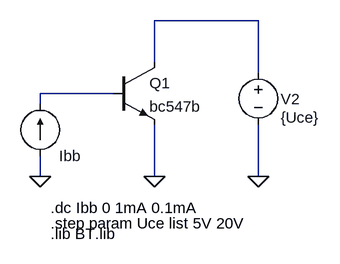
[diagram p0: schematic BT-CE-TRAN-2.asc]
BT-CE-TRAN-2.asc, the LTspice schematic file:
Version 4
SHEET 1 880 680
WIRE 368 16 208 16
WIRE 208 80 208 16
WIRE 368 96 368 16
WIRE 144 128 32 128
WIRE 32 144 32 128
WIRE 32 256 32 224
WIRE 208 256 208 176
WIRE 368 256 368 176
FLAG 208 256 0
FLAG 32 256 0
FLAG 368 256 0
SYMBOL voltage 368 80 R0
WINDOW 3 35 85 Left 2
WINDOW 123 0 0 Left 2
WINDOW 39 0 0 Left 2
WINDOW 0 35 57 Left 2
SYMATTR Value {Uce}
SYMATTR InstName V2
SYMBOL npn 144 80 R0
SYMATTR InstName Q1
SYMATTR Value bc547b
SYMBOL current 32 224 R180
WINDOW 0 -63 0 Left 2
WINDOW 3 -66 28 Invisible 2
WINDOW 123 0 0 Left 2
WINDOW 39 0 0 Left 2
SYMATTR InstName Ibb
SYMATTR Value 0
TEXT 48 304 Left 2 !.dc Ibb 0 1mA 0.1mA
TEXT 48 328 Left 2 !.step param Uce list 5V 20V
TEXT 48 344 Left 2 !.lib BT.lib

The netlist it stands for:
* BT-CE-TRAN-2.asc
V2 N001 0 {Uce}
Q1 N001 N002 0 0 bc547b
Ibb 0 N002 0
.model NPN NPN
.model PNP PNP
.lib standard.bjt
.dc Ibb 0 1mA 0.1mA
.step param Uce list 5V 20V
.lib BT.lib
.backanno
.end